# Altium schematic sheet Traffic Intersection.SchDoc
size A4
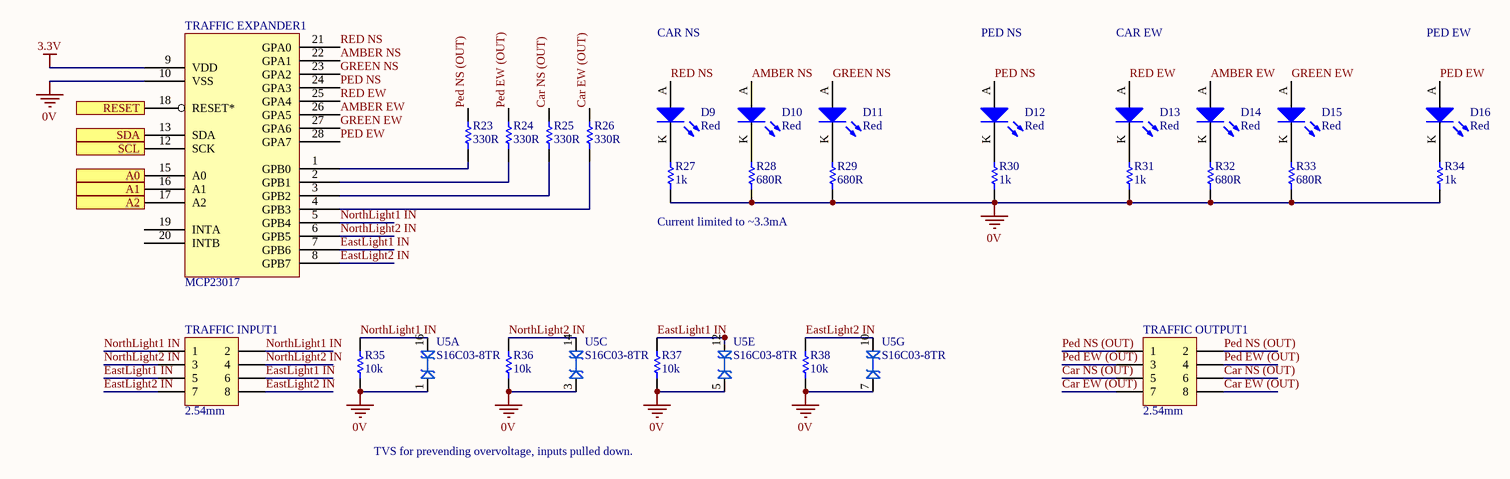
[diagram p0: Traffic Intersection.SchDoc]

## Parts
D9  Red  [0805 LED]
D10  Red  [0805 LED]
D11  Red  [0805 LED]
D12  Red  [0805 LED]
D13  Red  [0805 LED]
D14  Red  [0805 LED]
D15  Red  [0805 LED]
D16  Red  [0805 LED]
R23  330R  [0805]
R24  330R  [0805]
R25  330R  [0805]
R26  330R  [0805]
R27  1k  [0805]
R28  680R  [0805]
R29  680R  [0805]
R30  1k  [0805]
R31  1k  [0805]
R32  680R  [0805]
R33  680R  [0805]
R34  1k  [0805]
R35  10k  [0805]
R36  10k  [0805]
R37  10k  [0805]
R38  10k  [0805]
TRAFFIC_EXPANDER1  MCP23017  [Microchip 28-SOIC]
TRAFFIC_INPUT1  2.54mm  [Header 2x4]
TRAFFIC_OUTPUT1  2.54mm  [Header 2x4]
U5  S16C03-8TR  [SMC 16-SOIC]  (parts A,C,E,G of 8)

## Ports
A0, A1, A2, RESET, SCL, SDA

## Nets
0V: R27.1 R28.1 R29.1 R30.1 R31.1 R32.1 R33.1 R34.1 R35.1 R36.1 R37.1 R38.1 TRAFFIC_EXPANDER1.10(VSS) U5.1(A) U5.3(A) U5.5(A) U5.7(A)
3.3V: TRAFFIC_EXPANDER1.9(VDD)
A0: TRAFFIC_EXPANDER1.15(A0) ; port A0
A1: TRAFFIC_EXPANDER1.16(A1) ; port A1
A2: TRAFFIC_EXPANDER1.17(A2) ; port A2
AMBER EW: D14.A TRAFFIC_EXPANDER1.26(GPA5)
AMBER NS: D10.A TRAFFIC_EXPANDER1.22(GPA1)
Car EW (OUT): R26.2 TRAFFIC_OUTPUT1.7 TRAFFIC_OUTPUT1.8
Car NS (OUT): R25.2 TRAFFIC_OUTPUT1.5 TRAFFIC_OUTPUT1.6
EastLight1 IN: R37.2 TRAFFIC_EXPANDER1.7(GPB6) TRAFFIC_INPUT1.5 TRAFFIC_INPUT1.6 U5.12(A)
EastLight2 IN: R38.2 TRAFFIC_EXPANDER1.8(GPB7) TRAFFIC_INPUT1.7 TRAFFIC_INPUT1.8 U5.10(A)
GREEN EW: D15.A TRAFFIC_EXPANDER1.27(GPA6)
GREEN NS: D11.A TRAFFIC_EXPANDER1.23(GPA2)
NorthLight1 IN: R35.2 TRAFFIC_EXPANDER1.5(GPB4) TRAFFIC_INPUT1.1 TRAFFIC_INPUT1.2 U5.16(A)
NorthLight2 IN: R36.2 TRAFFIC_EXPANDER1.6(GPB5) TRAFFIC_INPUT1.3 TRAFFIC_INPUT1.4 U5.14(A)
PED EW: D16.A TRAFFIC_EXPANDER1.28(GPA7)
Ped EW (OUT): R24.2 TRAFFIC_OUTPUT1.3 TRAFFIC_OUTPUT1.4
PED NS: D12.A TRAFFIC_EXPANDER1.24(GPA3)
Ped NS (OUT): R23.2 TRAFFIC_OUTPUT1.1 TRAFFIC_OUTPUT1.2
RED EW: D13.A TRAFFIC_EXPANDER1.25(GPA4)
RED NS: D9.A TRAFFIC_EXPANDER1.21(GPA0)
RESET: TRAFFIC_EXPANDER1.18(RESET*) ; port RESET
SCL: TRAFFIC_EXPANDER1.12(SCK) ; port SCL
SDA: TRAFFIC_EXPANDER1.13(SDA) ; port SDA
NetD9_K: D9.K R27.2
NetD10_K: D10.K R28.2
NetD11_K: D11.K R29.2
NetD12_K: D12.K R30.2
NetD13_K: D13.K R31.2
NetD14_K: D14.K R32.2
NetD15_K: D15.K R33.2
NetD16_K: D16.K R34.2
NetR23_1: R23.1 TRAFFIC_EXPANDER1.1(GPB0)
NetR24_1: R24.1 TRAFFIC_EXPANDER1.2(GPB1)
NetR25_1: R25.1 TRAFFIC_EXPANDER1.3(GPB2)
NetR26_1: R26.1 TRAFFIC_EXPANDER1.4(GPB3)

Not connected (* = marked no-connect by the designer): TRAFFIC_EXPANDER1 19(INTA) 20(INTB)

## Notes on the sheet
- CAR NS
- PED NS
- CAR EW
- PED EW
- Current limited to ~3.3mA
- TVS for prevending overvoltage, inputs pulled down.
- Title
- Size:
- Date:
- A4
- Number:
- Time:
- Revision:
- Sheet
- of
- File:

## Library data of the parts
D9 D13 = SML-210LTT86: Red LED Indication - Discrete 1.75V 0805 (2012 Metric); Manufacturer: ROHM Semiconductor; Part Number: SML-210LTT86; Colour: Red; Digikey Part Number: 511-1286-1-ND; Digikey Link: https://www.digikey.com/product-detail/en/rohm-semiconductor/SML-210LTT86/511-1286-1-ND/637099
D10 D14 = SML-211DTT86: Orange LED Indication - Discrete 1.75V 0805 (2012 Metric); Manufacturer: ROHM Semiconductor; Part Number: SML-211DTT86; Colour: Red; Digikey Part Number: 511-1291-1-ND; Digikey Link: https://www.digikey.com/product-detail/en/rohm-semiconductor/SML-211DTT86/511-1291-1-ND/637104
D11 D12 D15 D16 = SML-210FTT86: Green LED Indication - Discrete 1.75V 0805 (2012 Metric); Manufacturer: ROHM Semiconductor; Part Number: SML-210FTT86; Colour: Red; Digikey Part Number: 511-1285-1-ND; Digikey Link: https://www.digikey.com/product-detail/en/rohm-semiconductor/SML-210FTT86/511-1285-1-ND/637098
R23-R26 = RC0805FR07330RL: Manufacturer: YAGEO; Tolerance: 0.01; Rated Voltage: 0.125W; Part Number: RC0805FR07330RL; Value: 330R; Material: FR-07; qty: 50
R27 R30 R31 R34 = RC0805FR071KL: Manufacturer: YAGEO; Tolerance: 0.01; Rated Voltage: 0.125W; Part Number: RC0805FR071KL; Value: 1k; Material: FR-07; qty: 50
R28 R29 R32 R33 = RC0805FR07680RL: Manufacturer: YAGEO; Tolerance: 0.01; Rated Voltage: 0.125W; Part Number: RC0805FR07680RL; Value: 680R; Material: FR-07; qty: 50
R35-R38 = RC0805FR0710KL: Manufacturer: YAGEO; Tolerance: 0.01; Rated Voltage: 0.125W; Part Number: RC0805FR0710KL; Value: 10k; Material: FR-07; qty: 50
TRAFFIC_EXPANDER1 = MCP23017: IC I/O EXPANDER I2C 16B 28SOIC; Manufacturer: Microchip Technology; Part Number: MCP23017; Digikey Part Number: MCP23017T-E/SOTR-ND; Digikey Link: https://www.digikey.com/product-detail/en/microchip-technology/MCP23017T-E-SO/MCP23017T-E-SOTR-ND/964184
TRAFFIC_INPUT1 TRAFFIC_OUTPUT1 = Header 2x4: Positions: 8; Angle: 0; Flange: No; Contact: NA; Part Number: Header 2x4; Pitch: 2.54mm; Row Spacing: 2.54mm
U5 = S16C03-8TR: PD 300W VWM 3.3VCJ 425PFPACKAGE; Manufacturer: SMC Diode; Part Number: S16C03-8TR; Digikey Part Number: 1655-2152-2-ND; Digikey Link: https://www.digikey.com/product-detail/en/smc-diode-solutions/S16C03-8TR/1655-2152-2-ND/9816814